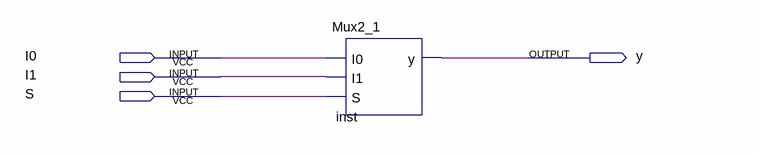
[diagram p0: schematic sheet]
// Quartus schematic MuxDemo.bdf as structural Verilog: 1 symbols, 4 pins
module MuxDemo (
  input  I0,
  input  I1,
  input  S,
  output y
);

  Mux2_1 inst (.I0(I0), .I1(I1), .S(S), .y(y));
endmodule
